# Altium schematic sheet Alarm_LCD.SchDoc
size A; SheetNumber: 1; SheetTotal: 1
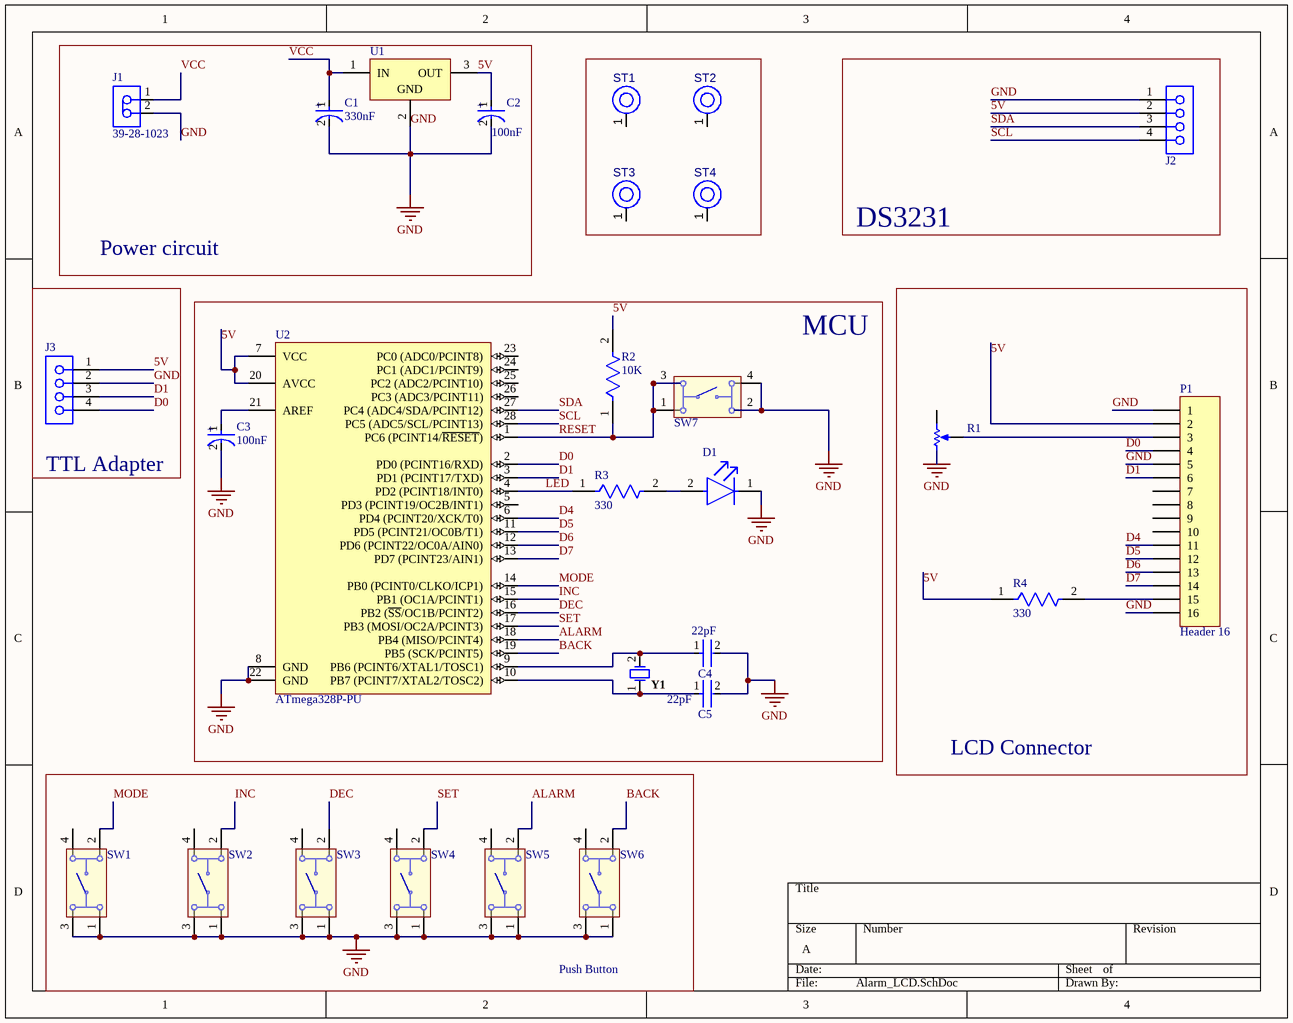
[diagram p0: Alarm_LCD.SchDoc]

## Parts
C1  330nF  [FP-EEU-FC1V221L-MFG]
C2  100nF  [FP-EEU-FC1V221L-MFG]
C3  100nF  [FP-EEU-FC1V221L-MFG]
C4  22pF  [FP-RDE0M1-MFG]
C5  22pF  [FP-RDE0M1-MFG]
D1  HLMP-1719  [FP-HLMP-1719-MFG]  (value not drawn)
J1  39-28-1023  [MOLX-39-28-1023-2_V]
J2  SLW-104-01-T-S  [SMTC-SLW-104-01-X-S]  (value not drawn)
J3  SLW-104-01-T-S  [SMTC-SLW-104-01-X-S]  (value not drawn)
P1  Header 16  [HDR1X16]
R1  3266W-1-104LF  [BOUR-3266W-3_V]  (value not drawn)
R2  10K  [FP-CF14-MFG]
R3  330  [FP-CF14-MFG]
R4  330  [FP-CF14-MFG]
ST1  PTH-M2D5X5  [PTH-M2D5X5]  (value not drawn)  (no BOM)
ST2  PTH-M2D5X5  [PTH-M2D5X5]  (value not drawn)  (no BOM)
ST3  PTH-M2D5X5  [PTH-M2D5X5]  (value not drawn)  (no BOM)
ST4  PTH-M2D5X5  [PTH-M2D5X5]  (value not drawn)  (no BOM)
SW1  430186070716  [430186070716]  (value not drawn)
SW2  430186070716  [430186070716]  (value not drawn)
SW3  430186070716  [430186070716]  (value not drawn)
SW4  430186070716  [430186070716]  (value not drawn)
SW5  430186070716  [430186070716]  (value not drawn)
SW6  430186070716  [430186070716]  (value not drawn)
SW7  430186070716  [430186070716]  (value not drawn)
U1  L7805CV  [TO220]  (value not drawn)
U2  ATmega328P-PU  [28P3]
Y1  FOXSLF/120-20  [FOX-FOXSLF-2_V]  (value not drawn)

## Blocks framed on the sheet
Power circuit: C1 C2 J1 U1
DS3231: J2
TTL Adapter: J3
LCD Connector: P1 R1 R4
MCU: C3-C5 D1 R2 R3 SW7 U2 Y1
Push Button: SW1-SW6

## Nets
GND: C1.2(A) C2.2(A) C3.2(A) C4.2 C5.2 D1.1(C) J1.2 J2.1 J3.2 P1.1 P1.5 P1.16 R1.1(CCW) SW1.1 SW1.3 SW2.1 SW2.3 SW3.1 SW3.3 SW4.1 SW4.3 SW5.1 SW5.3 SW6.1 SW6.3 SW7.2 SW7.4 U1.2(GND) U2.8(GND) U2.22(GND)
5V: C2.1(C) J2.2 J3.1 P1.2 R2.2 R4.1 U1.3(OUT) U2.7(VCC) U2.20(AVCC)
ALARM: SW5.2 U2.18(PB4_(MISO/PCINT4))
BACK: SW6.2 U2.19(PB5_(SCK/PCINT5))
D0: J3.4 P1.4 U2.2(PD0_(PCINT16/RXD))
D1: J3.3 P1.6 U2.3(PD1_(PCINT17/TXD))
D4: P1.11 U2.6(PD4_(PCINT20/XCK/T0))
D5: P1.12 U2.11(PD5_(PCINT21/OC0B/T1))
D6: P1.13 U2.12(PD6_(PCINT22/OC0A/AIN0))
D7: P1.14 U2.13(PD7_(PCINT23/AIN1))
DEC: SW3.2 U2.16(PB2_(~{SS}/OC1B/PCINT2))
INC: SW2.2 U2.15(PB1_(OC1A/PCINT1))
LED: R3.1 U2.4(PD2_(PCINT18/INT0))
MODE: SW1.2 U2.14(PB0_(PCINT0/CLKO/ICP1))
RESET: R2.1 SW7.1 SW7.3 U2.1(PC6_(PCINT14/~{RESET}))
SCL: J2.4 U2.28(PC5_(ADC5/SCL/PCINT13))
SDA: J2.3 U2.27(PC4_(ADC4/SDA/PCINT12))
SET: SW4.2 U2.17(PB3_(MOSI/OC2A/PCINT3))
VCC: C1.1(C) J1.1 U1.1(IN)
NetC3_1: C3.1(C) U2.21(AREF)
NetC4_1: C4.1 U2.9(PB6_(PCINT6/XTAL1/TOSC1)) Y1.2
NetC5_1: C5.1 U2.10(PB7_(PCINT7/XTAL2/TOSC2)) Y1.1
NetD1_2: D1.2(A) R3.2
NetP1_3: P1.3 R1.2(WIPER)
NetP1_15: P1.15 R4.2

Not connected (* = marked no-connect by the designer): P1 7 8 9 10; R1 3(CW); ST1 1(H1); ST2 1(H1); ST3 1(H1); ST4 1(H1); SW1 4; SW2 4; SW3 4; SW4 4; SW5 4; SW6 4; U2 5(PD3_(PCINT19/OC2B/INT1)) 23(PC0_(ADC0/PCINT8)) 24(PC1_(ADC1/PCINT9)) 25(PC2_(ADC2/PCINT10)) 26(PC3_(ADC3/PCINT11))

## Notes on the sheet
- (in symbol CMP-05427-000010-1) +

## Library data of the parts
C1-C3 = CMP-05427-000010-1: CAP ALUM 220UF 20% 35V RADIAL; Manufacturer: Panasonic Electronic Components; Manufacturer Part Number: EEU-FC1V221L; Material: Aluminum; Leakage Current: 77uA; Esr: 0.085Ω; Life: 2000Hours; Automotive Grade: Grade 2; Dissipation Factor: 12%; Ripple Current: 730mA; Octopart: https://octopart.com/eeu-fc1v221l-panasonic-39478519; ComponentLink2URL: https://industrial.panasonic.com/cdbs/www-data/pdf/RDF0000/ABA0000C1209.pdf; Package: 0; Height: 16.5mm; Category: Cap; ComponentLink2Description: Datasheet; Lead Free: Yes; Device Class L2: Capacitors; Temperature Range High: +105°C; Mouser Description: Capacitor; Aluminum Electrolytic; Fc Radial Elec Cap 220uF 35V; Temperature: -55°C to +105°C; Digikey Description: CAP ALUM 220UF 20% 35V RADIAL; Device Class L3: Aluminum Electrolytic Capacitors; Device Class L1: Passive Components; Automotive: Yes; RoHS: TRUE; Temperature Range Low: -55°C; Voltage Rating: 35V; Tolerance: 20%
  C1: Value: 330nF; Capacitance: 330nF
  C2 C3: Value: 100nF; Capacitance: 100nF
C4 C5 = CMP-06035-051680-1: Ceramic Capacitor 100nF ±10% 50V X7R Radial; Lead/Base Style: Kinked; Lead Diameter: 0.5mm; Lead Free: Lead Free; Mount: Through Hole; Package Quantity: 2000; Lead Pitch: 0.197inch; Capacitance: 22pF; Case/Package: Radial; Tolerance: 10%; Height - Seated (Max): 0.236inch; Max Operating Temperature: 125°C; Dielectric: X7R; Min Operating Temperature: -55°C; Voltage Rating (DC): 50V; Voltage Rating: 50V; Termination: Radial; Height: 3.5mm; Resistor Type: Ceramic; Width: 3.5mm; Packaging: Tape and Reel; Length: 0.157inch
D1 = CMP-2000-06410-2: LED YELLOW DIFFUSED T-1 T/H; Manufacturer: Broadcom; Wavelength: 585nm; Led Orientation: Straight; Luminous Intensity: 2.1mcd; Forward Voltage: 1.8V; Viewing Angle: 50°; Reverse Voltage: 5V; Power Dissipation: 17.5mW; Forward Current: 2mA; Lead Free: Yes; Automotive: No; Device Class L1: Optoelectronics; Mouser Description: Standard LEDs - Through Hole Yellow Diffused 585nm 2.1mcd; Digikey Description: LED YELLOW DIFFUSED T-1 T/H; Temperature: -40°C to +100°C; Temperature Range High: +100°C; Package: 0; Category: Diode; Colour: Yellow; Device Class L2: LEDs; ComponentLink2Description: Datasheet; ComponentLink2URL: https://docs.broadcom.com/docs/AV02-1557EN; Temperature Range Low: -40°C; Device Class L3: unset; Octopart: https://octopart.com/hlmp-1719-broadcom-71130405; RoHS: TRUE; Manufacturer Part Number: HLMP-1719
J1 = CMP-2000-05244-1: Female Header, Pitch 4.2 mm, 1 x 2 Position, Height 12.8 mm, Tail Length 3.5 mm, -40 to 105 degC, RoHS; Manufacturer: Molex; No. of Poles: 2; Working Voltage: 250V; No. of Rows: 1; Current Rating: 13A; Contact Termination: Solder; No. of Contacts: 4; Connector Body Material: –; Voltage Rating V AC: 600V; Mounting Orientation: Straight; Pitch Spacing: 4.2mm; Connector Mounting: PCB; Connector Type: RectangularPower; Manufacturer URL: http://www.molex.com/; Contact Plating: Tin; Gender: Header; Lead Spacing: 4.2mm; Colour: Clear; Series: Mini-FitJr; No. of Ways: 2; MSL: –; Connector Insert Type: Header; Flammability Rating: UL94V-2; Datasheet URL: https://datasheet.ciiva.com/11746/0900766b80460d9e-11746456.pdf; Termination Method: Solder; Mounting Type: PCBoard; Contact Material: Brass; Datasheet Version: Rev. F, 05/2004; SVHC: –; Connector Mounting Orientation: PCB; Contact Gender: –
J2 J3 = CMP-1023-00131-1: Low Profile Socket Strips, Through-hole, Vertical, -55 to 105 degC, 2.54 mm Pitch, 4-Pin, Female, RoHS; Manufacturer: Samtec; Pitch: 2.54 mm; ComponentLink2Description: Datasheet; Temperature Range: -55 to 105 degC; RoHS: True; PackageDescription: Low Profile Socket Strip; PackageVersion: X, 9/1987; Orientation: Vertical; ComponentLink2URL: http://www.samtec.com/documents/webfiles/pdf/SLW.PDF; ComponentLink1URL: http://www.samtec.com; ComponentLink3URL: http://www.samtec.com/documents/webfiles/cpdf/SLW-1XX-01-X-X-MKT.pdf; PackageReference: SLW-104-01-X-S; ComponentLink1Description: Manufacturer URL; DatasheetVersion: F-214; ComponentLink3Description: Package Specification; Mounting Technology: Through-hole; PartNumber: SLW-104-01-T-S
P1 = Header 16: Header, 16-Pin; LatestRevisionDate: 17-Jul-2002; LatestRevisionNote: Re-released for DXP Platform.; Publisher: Altium Limited
R1 = CMP-0975-00021-1: Square Trimpot Trimming Potentiometer, 100 KOhm, 0.25 W, -55 to 125 degC, 3-Pin THD, RoHS, Tube; Manufacturer: Bourns; Power Rating@70 degC: 0.25 W; Tolerance: +/-10%; ComponentLink2URL: https://www.bourns.com/data/global/pdfs/3266.pdf; ComponentLink3Description: Package Specification; ComponentLink1URL: https://www.bourns.com/; ComponentLink2Description: Datasheet; DatasheetVersion: Apr-14; ComponentLink3URL: https://www.bourns.com/data/global/pdfs/3266.pdf; Mounting Technology: Through Hole; Packing: Tube; PackageDescription: 3-Pin THD, Body 6.35 x 4.31 mm, Pitch 2.54 mm; ComponentLink1Description: Manufacturer URL; Operating Temperature: -55 to 125 degC; PartNumber: 3266W-1-104LF; Resistance: 100 kOhm; RoHS: TRUE
R2-R4 = CMP-26528-000003-1: RES 7.5K OHM 1/4W 5% AXIAL; Max Power Dissipation: 250mW; Temperature Coefficient: -400ppm/°C; RoHS Compliant: Yes; Lead Free: Lead Free; Max Operating Temperature: 155°C; Case/Package: Axial; Tolerance: 5%; Power Rating: 250mW; Diameter: 2.3mm; Features: Flame Retardant Coating; Series: CF; Resistor Type: Carbon Film; Number of Terminations: 2; Length: 0.256inch; Min Operating Temperature: -55°C; Contact Plating: Tin; Packaging: Tape and Reel; Mount: Through Hole; Radiation Hardening: No
  R2: Resistance: 10K
  R3 R4: Resistance: 330
ST1-ST4 = CMP-00028-00004-1: M2 PTH (2.5mm), 5mm pad; Pins: 1
SW1-SW7 = CMP-1453-00013-1: WS-TATV THT Tact Switch 6X6 mm; Manufacturer: Wuerth Elektronik; NoPins: 04; PackageReference: 430186070716; ComponentLink2Description: Datasheet; ComponentLink1Description: Manufacturer URL; PartNumber: 430186070716; ComponentLink2URL: http://katalog.we-online.de/em/datasheet/4301x6.pdf; ComponentLink1URL: http://www.we-online.com
U1 = CMP-019-00018-2: Positive Voltage Regulator IC, 1.5 A, 5 V, 0 to 125 degC, 3-Pin TO-220, RoHS, Tube; Manufacturer: STMicroelectronics; Dropout Voltage: 2V; Outputs: 1; Min Input Voltage: 7V; Output Current: 1.5A; Nominal Output Voltage: 5V; Max Supply Voltage: 20V; Min Supply Voltage: 8V; Max Input Voltage: 35V; Manufacturer URL: http://www.st.com/; Datasheet Version: Rev 30, 09/2012; Min Operating Temperature: 0°C; Pins: 3; Max Operating Temperature: 125°C; RoHS Compliant: True; Output Voltage: 5V; Mounting Technology: TH; Package Quantity: 50; Datasheet URL: https://datasheet.ciiva.com/15111/getdatasheetpartid-44136-15111027.pdf; Case/Package: TO-220; Packaging: Rail/Tube; Max Ouput Current: 1.5A
U2 = CMP-0095-00013-2: 8-bit AVR Microcontroller, 32KB Flash, 1KB EEPROM, 2KB SRAM, 28-pin PDIP, Industrial Grade (-40°C to 85°C); RevisionNote: DatasheetVersion updated. URLs added.; PackageVersion: revB, Sep-2001; PackageDescription: 28-lead (0.300"/7.62mm Wide) Plastic Dual Inline Package (PDIP); DatasheetVersion: revD, May-2011; ComponentLink1Description: Manufacturer URL; ComponentLink1URL: http://www.atmel.com/; PackageReference: 28P3; ComponentLink2Description: ATmega48A/48PA/88A/88PA/168A/168PA/328/328P Datasheet; ComponentLink3URL: http://www.atmel.com/dyn/resources/prod_documents/8271S.pdf; ComponentLink2URL: http://www.atmel.com/dyn/resources/prod_documents/8271.pdf; ComponentLink3Description: ATmega48A/48PA/88A/88PA/168A/168PA/328/328P Summary
Y1 = CMP-1749-00004-1: Resistance Weld Thru-Hole Crystal, 12 MHz, +/-30 ppm, -20 to 70 degC, 2-Pin THD, RoHS, Bulk; Elements: 1; Rds On Max: 115 mohm; Typical Rise Time: 90 ns; Max Power Dissipation: 2.5 W; Case\Package: TO-251-3; Input Capacitance: 350 pF; REACH SVHC: No SVHC; Length: 6.6 mm; ComponentLink1URL: http://www.foxonline.com/; PackageDescription: 2-Pin Through Hole Device, Body 11.35 x 4.65 mm, Pitch 4.88 mm; Radiation Hardening: No; Package Quantity: 70; Packaging: Rail/Tube; ComponentLink1Description: Manufacturer URL; Min Operating Temperature: -55 degC; Max Operating Temperature: 150 degC; RoHSCompliant: true; PackageReference: FOXSLF-2; DatasheetVersion: Mar-15; Pins: 3; Height: 6.1 mm; Mount: Through Hole; ComponentLink2URL: http://www.foxonline.com/pdfs/hc49slf.pdf; ComponentLink2Description: Datasheet; Width: 2.3 mm